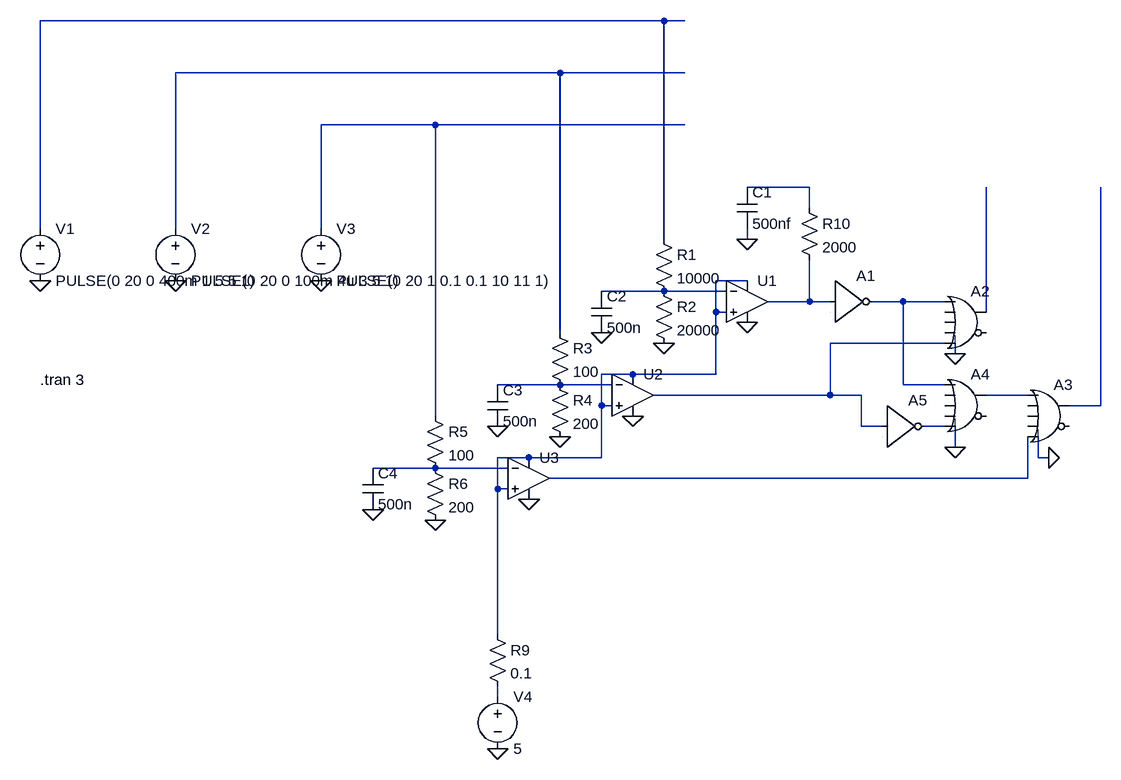
[diagram p0: schematic Switching Logic OLD.asc]
Switching Logic OLD.asc, the LTspice schematic file:
Version 4.1
SHEET 1 2964 1760
WIRE 928 -144 -32 -144
WIRE 960 -144 928 -144
WIRE 768 -64 176 -64
WIRE 960 -64 768 -64
WIRE 576 16 400 16
WIRE 960 16 576 16
WIRE 1152 112 1056 112
WIRE 1152 144 1152 112
WIRE -32 176 -32 -144
WIRE 176 176 176 -64
WIRE 400 176 400 16
WIRE 928 192 928 -144
WIRE 1056 192 1056 176
WIRE 1056 256 1008 256
WIRE 928 272 832 272
WIRE 1024 272 928 272
WIRE 1152 288 1152 224
WIRE 1152 288 1088 288
WIRE 1184 288 1152 288
WIRE 1296 288 1248 288
WIRE 1360 288 1296 288
WIRE 1008 304 1008 256
WIRE 1024 304 1008 304
WIRE 1424 304 1424 112
WIRE 768 336 768 -64
WIRE 1360 352 1184 352
WIRE 1376 368 1376 352
WIRE 880 400 832 400
WIRE 1008 400 1008 304
WIRE 1008 400 880 400
WIRE 768 416 672 416
WIRE 848 416 768 416
WIRE 1296 416 1296 288
WIRE 1360 416 1296 416
WIRE 1184 432 1184 352
WIRE 1184 432 912 432
WIRE 1232 432 1184 432
WIRE 1488 432 1424 432
WIRE 832 448 832 400
WIRE 848 448 832 448
WIRE 1600 448 1600 112
WIRE 1600 448 1552 448
WIRE 576 464 576 16
WIRE 1232 480 1232 432
WIRE 1264 480 1232 480
WIRE 1360 480 1328 480
WIRE 1376 512 1376 480
WIRE 720 528 672 528
WIRE 832 528 832 448
WIRE 832 528 720 528
WIRE 1504 528 1504 496
WIRE 1520 528 1504 528
WIRE 576 544 480 544
WIRE 688 544 576 544
WIRE 1488 560 1488 496
WIRE 1488 560 752 560
WIRE 672 576 672 528
WIRE 688 576 672 576
WIRE 672 800 672 576
WIRE 672 896 672 880
FLAG 928 352 0
FLAG 768 496 0
FLAG 576 624 0
FLAG 672 976 0
FLAG 400 256 0
FLAG 176 256 0
FLAG -32 256 0
FLAG 1056 320 0
FLAG 880 464 0
FLAG 720 592 0
FLAG 1376 368 0
FLAG 1376 512 0
FLAG 1520 528 0
FLAG 1056 192 0
FLAG 832 336 0
FLAG 672 480 0
FLAG 480 608 0
SYMBOL voltage -32 160 R0
WINDOW 123 0 0 Left 0
WINDOW 39 0 0 Left 0
SYMATTR InstName V1
SYMATTR Value PULSE(0 20 0 400m 1 5 5 1)
SYMBOL voltage 176 160 R0
WINDOW 123 0 0 Left 0
WINDOW 39 0 0 Left 0
SYMATTR InstName V2
SYMATTR Value PULSE(0 20 0 100m 4u 3 5 1)
SYMBOL voltage 400 160 R0
WINDOW 123 0 0 Left 0
WINDOW 39 0 0 Left 0
SYMATTR InstName V3
SYMATTR Value PULSE(0 20 1 0.1 0.1 10 11 1)
SYMBOL OpAmps\\UniversalOpAmp2 1056 288 R0
SYMATTR InstName U1
SYMBOL OpAmps\\UniversalOpAmp2 880 432 R0
SYMATTR InstName U2
SYMBOL OpAmps\\UniversalOpAmp2 720 560 R0
SYMATTR InstName U3
SYMBOL res 912 176 R0
SYMATTR InstName R1
SYMATTR Value 10000
SYMBOL res 912 256 R0
SYMATTR InstName R2
SYMATTR Value 20000
SYMBOL res 752 320 R0
SYMATTR InstName R3
SYMATTR Value 100
SYMBOL res 752 400 R0
SYMATTR InstName R4
SYMATTR Value 200
SYMBOL res 560 448 R0
SYMATTR InstName R5
SYMATTR Value 100
SYMBOL res 560 528 R0
SYMATTR InstName R6
SYMATTR Value 200
SYMBOL voltage 672 880 R0
WINDOW 123 0 0 Left 0
WINDOW 39 0 0 Left 0
SYMATTR InstName V4
SYMATTR Value 5
SYMBOL Digital\\inv 1184 224 R0
SYMATTR InstName A1
SYMBOL Digital\\or 1392 256 R0
SYMATTR InstName A2
SYMBOL Digital\\or 1392 384 R0
SYMATTR InstName A4
SYMBOL Digital\\inv 1264 416 R0
SYMATTR InstName A5
SYMBOL Digital\\or 1520 400 R0
SYMATTR InstName A3
SYMBOL res 656 784 R0
SYMATTR InstName R9
SYMATTR Value 0.1
SYMBOL res 1136 128 R0
SYMATTR InstName R10
SYMATTR Value 2000
SYMBOL cap 1040 112 R0
SYMATTR InstName C1
SYMATTR Value 500nf
SYMBOL cap 816 272 R0
SYMATTR InstName C2
SYMATTR Value 500n
SYMBOL cap 656 416 R0
SYMATTR InstName C3
SYMATTR Value 500n
SYMBOL cap 464 544 R0
SYMATTR InstName C4
SYMATTR Value 500n
TEXT -32 408 Left 2 !.tran 3

The netlist it stands for:
* Switching Logic OLD.asc
V1 N001 0 PULSE(0 20 0 400m 1 5 5 1)
V2 N002 0 PULSE(0 20 0 100m 4u 3 5 1)
V3 N003 0 PULSE(0 20 1 0.1 0.1 10 11 1)
X§U1 N005 N006 N005 0 N007 level2 Avol=1Meg GBW=10Meg Slew=10Meg Ilimit=25m Rail=0 Vos=0 En=0 Enk=0 In=0 Ink=0 Rin=500Meg  ; pins In+ In- V+ V- OUT
X§U2 N005 N011 N005 0 N010 level2 Avol=1Meg GBW=10Meg Slew=10Meg Ilimit=25m Rail=0 Vos=0 En=0 Enk=0 In=0 Ink=0 Rin=500Meg  ; pins In+ In- V+ V- OUT
X§U3 N005 N015 N005 0 N016 level2 Avol=1Meg GBW=10Meg Slew=10Meg Ilimit=25m Rail=0 Vos=0 En=0 Enk=0 In=0 Ink=0 Rin=500Meg  ; pins In+ In- V+ V- OUT
R1 N001 N006 10000
R2 N006 0 20000
R3 N002 N011 100
R4 N011 0 200
R5 N003 N015 100
R6 N015 0 200
V4 N017 0 5
A1 N007 0 0 0 0 N008 0 0 BUF
A2 N008 0 0 0 N010 0 N009 0 OR
A4 N008 0 0 0 N014 0 N012 0 OR
A5 N010 0 0 0 0 N014 0 0 BUF
A3 N012 0 0 0 N016 0 N013 0 OR
R9 N005 N017 0.1
R10 N004 N007 2000
C1 N004 0 500nf
C2 N006 0 500n
C3 N011 0 500n
C4 N015 0 500n
.tran 3
.lib UniversalOpAmp2.lib
.backanno
.end